# EasyEDA schematic SCH_laser-read-ldr_2022-01-18.json
TITLE: laser read ldr; REV: 1.0; Date: 2022-01-18; Sheet: 1/1; Drawn By: Martin Cornu; Company: MartInc
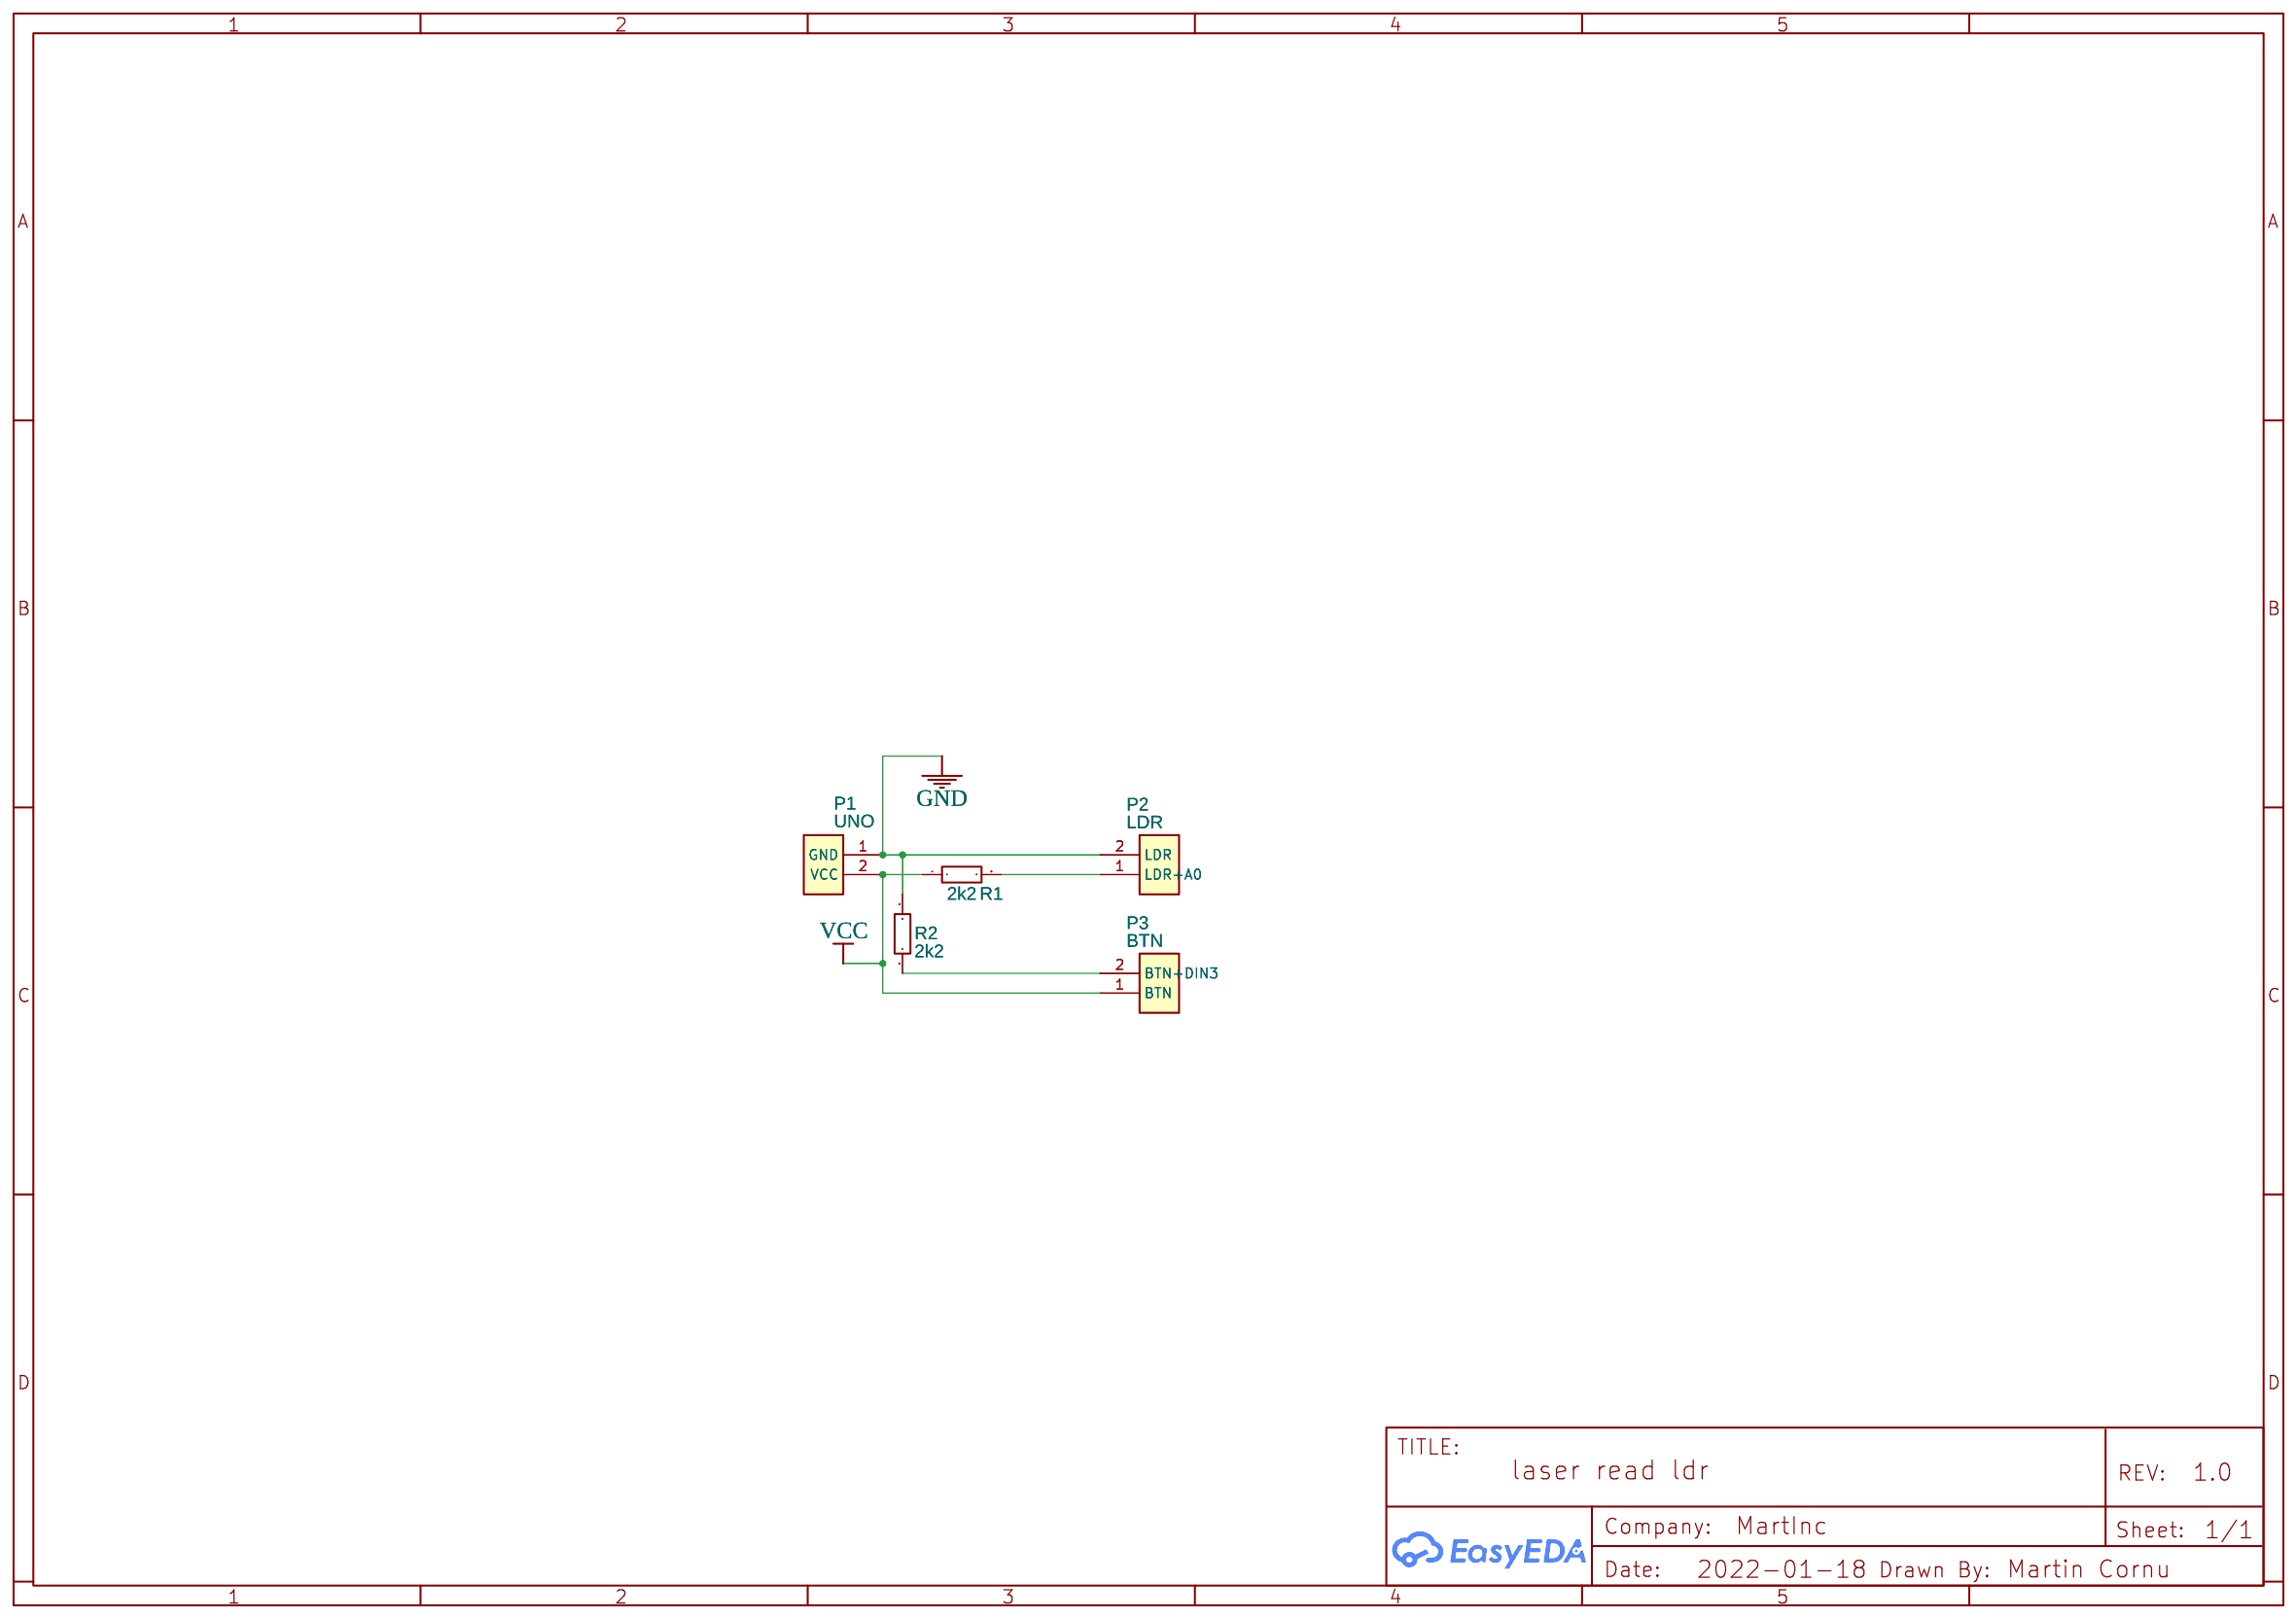
[diagram p0: schematic sheet]

## Parts
P1  UNO  [TERMINAL_BLOCK-2P-5MM]
P2  LDR  [TERMINAL_BLOCK-2P-5MM]
P3  BTN  [TERMINAL_BLOCK-2P-5MM]
R1  2k2  [RES2M]
R2  2k2  [RES2M]

## Library data of the parts
P1-P3 = TERMINAL_2P_5MM: Supplier Part: undefined; Contributor: Ivan75
R1 R2 = Resistor2m: Supplier: LCSC; Supplier Part: C348838; Manufacturer: ResistorToday; Manufacturer Part: EWWR0001J20R0T9; Contributor: forthres

## Nets
GND: P1.1(GND) P2.2(LDR) R2.2
VCC: P1.2(VCC) P3.1(BTN) R1.1
Net-(P2-1): P2.1(LDR+A0) R1.2
Net-(P3-2): P3.2(BTN+DIN3) R2.1
